# EAGLE schematic base (EAGLE 9.5.1)

## Sheet 1 of 2: ESP32 and peripherals
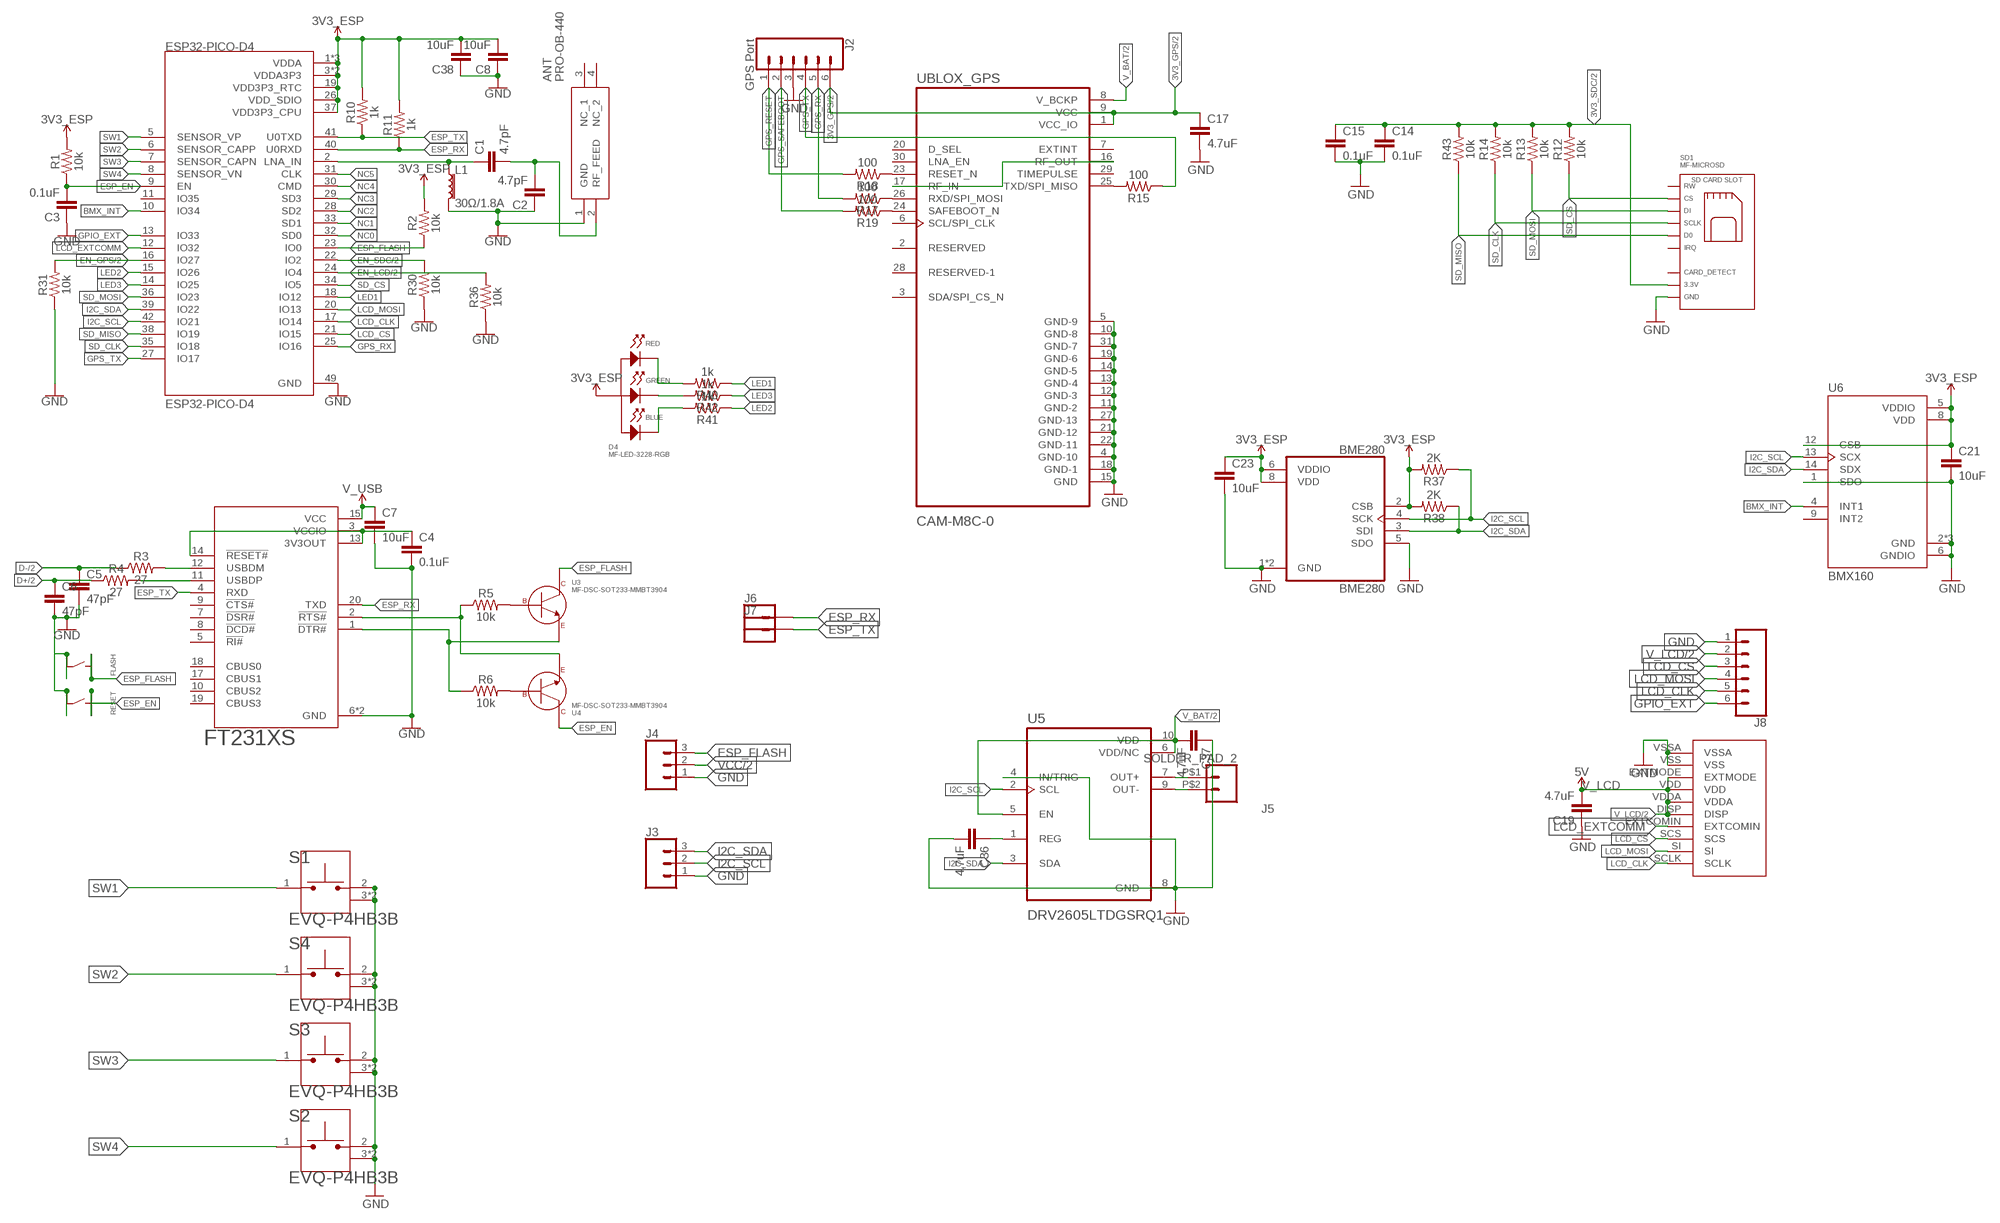
[diagram p0: schematic, sheet 1]

### Parts
ANT  PRO-OB-440  [PRO-OB-440_1]
BME280  BME280  [PSON65P250X250X100-8N]
C1  4.7pF  4.7PF-0603-50V-5%  [C0603]
C2  4.7pF  4.7PF-0603-50V-5%  [C0603]
C3  0.1uF  0.1UF-0603-25V-(+80/-20%)  [C0603]
C4  0.1uF  0.1UF-0603-25V-(+80/-20%)  [C0603]
C5  47pF  47PF-0603-50V-5%  [C0603]
C6  47pF  47PF-0603-50V-5%  [C0603]
C7  10uF  2.2UF-0603-10V-20%  [C0603]
C8  10uF  4.7PF-0603-50V-5%  [C0603]
C14  0.1uF  0.1UF-0603-25V-(+80/-20%)  [C0603]
C15  0.1uF  0.1UF-0603-25V-(+80/-20%)  [C0603]
C17  4.7uF  0.1UF-0603-25V-5%  [C0603]
C19  4.7uF  4.7UF-0603-6.3V-(10%)  [C0603]
C21  10uF  10UF-0603-6.3V-20%  [C0603]
C23  10uF  10UF-0603-6.3V-20%  [C0603]
C36  4.7uF  4.7UF-0603-6.3V-(10%)  [C0603]
C37  4.7uF  4.7UF-0603-6.3V-(10%)  [C0603]
C38  10uF  4.7PF-0603-50V-5%  [C0603]
D4  MF-LED-3228-RGB  LED_RGB_CA_PLCC4  [PLCC4]
ESP32-PICO-D4  ESP32-PICO-D4  [PQFN50P700X700X104-49N]
FLASH  MF-SW-TACT-4.2MM  TACT_4.2MM  [TACT4.2MM]
FT231  FT231XS  FT231XS-UTSSOP20  [TSSOP20]
J2  GPS Port  CONN_06LOCK  [1X06_LOCK]
J3  CONN_03LOCK  [1X03_LOCK]
J4  CONN_03LOCK  [1X03_LOCK]
J5  SOLDER_PAD_2  [SOLDER_PAD_2]
J6  CONN_01  [1X01]
J7  CONN_01  [1X01]
J8  CONN_06LOCK  [1X06_LOCK]
L1  30Ω/1.8A  FERRITE_BEAD-0603  [L0603]
R1  10k  10KOHM-0603-1/10W-1%  [R0603]
R2  10k  10KOHM-0603-1/10W-1%  [R0603]
R3  27  27OHM-0603-1/10W-1%  [R0603]
R4  27  27OHM-0603-1/10W-1%  [R0603]
R5  10k  10KOHM-0603-1/10W-1%  [R0603]
R6  10k  10KOHM-0603-1/10W-1%  [R0603]
R10  1k  1KOHM-0603-1/10W-1%  [R0603]
R11  1k  1KOHM-0603-1/10W-1%  [R0603]
R12  10k  10KOHM-0603-1/10W-1%  [R0603]
R13  10k  10KOHM-0603-1/10W-1%  [R0603]
R14  10k  10KOHM-0603-1/10W-1%  [R0603]
R15  100  1KOHM-0603-1/10W-1%  [R0603]
R17  100  1KOHM-0603-1/10W-1%  [R0603]
R18  100  1KOHM-0603-1/10W-1%  [R0603]
R19  100  1KOHM-0603-1/10W-1%  [R0603]
R30  10k  10KOHM-0603-1/10W-1%  [R0603]
R31  10k  10KOHM-0603-1/10W-1%  [R0603]
R36  10k  10KOHM-0603-1/10W-1%  [R0603]
R37  2K  1KOHM-0603-1/10W-1%  [R0603]
R38  2K  1KOHM-0603-1/10W-1%  [R0603]
R40  1k  1KOHM-0603-1/10W-1%  [R0603]
R41  1k  1KOHM-0603-1/10W-1%  [R0603]
R42  1k  1KOHM-0603-1/10W-1%  [R0603]
R43  10k  10KOHM-0603-1/10W-1%  [R0603]
RESET  MF-SW-TACT-4.2MM  TACT_4.2MM  [TACT4.2MM]
S1  EVQ-P4HB3B  [SW_EVQ-P4HB3B]
S2  EVQ-P4HB3B  [SW_EVQ-P4HB3B]
S3  EVQ-P4HB3B  [SW_EVQ-P4HB3B]
S4  EVQ-P4HB3B  [SW_EVQ-P4HB3B]
SD1  MF-MICROSD  SD_CARD_SLOT_MICRO_RIGHT  [MF-MICROSD]
U3  MF-DSC-SOT233-MMBT3904  NPN_BJTMMBT3904_SOT-23-3  [SOT-23-3]
U4  MF-DSC-SOT233-MMBT3904  NPN_BJTMMBT3904_SOT-23-3  [SOT-23-3]
U5  DRV2605LTDGSRQ1  [SOP50P490X110-10N]
U6  BMX160  [PQFN50P250X300X100-14N]
U$5  51441-1093  LS027B_LCD_SHARPFH12-10S-0.5SH  [FH12-10S-0.5SH]
UBLOX_GPS  CAM-M8C-0  [LCC100P960X1400X210-31N]

### Nets
3V3_GPS: C17.1 J2.6 UBLOX_GPS.1(VCC_IO) UBLOX_GPS.9(VCC) ; also sheet 2
3V3_SDC: C14.1 C15.1 R12.2 R13.2 R14.2 R43.2 SD1.PIN4(3.3V) ; also sheet 2
BMX_INT: ESP32-PICO-D4.10(IO34) U6.4(INT1)
D+: C6.1 R4.1 ; also sheet 2
D-: C5.1 R3.1 ; also sheet 2
EN_GPS: ESP32-PICO-D4.16(IO27) R31.2 ; also sheet 2
EN_LCD: ESP32-PICO-D4.24(IO4) R36.2 ; also sheet 2
EN_SDC: ESP32-PICO-D4.22(IO2) R30.2 ; also sheet 2
ESP_EN: C3.2 ESP32-PICO-D4.9(EN) R1.1 RESET.P$1 RESET.P$2 U4.P$3(COLLECTOR)
ESP_FLASH: ESP32-PICO-D4.23(IO0) FLASH.P$1 FLASH.P$2 J4.3 R2.1 U3.P$3(COLLECTOR)
ESP_RX: ESP32-PICO-D4.40(U0RXD) FT231.20(TXD) J6.1 R11.1
ESP_TX: ESP32-PICO-D4.41(U0TXD) FT231.4(RXD) J7.1 R10.1
GND: ANT.1(GND) BME280.1(GND) BME280.5(SDO) BME280.7(GND) C2.1 C3.1 C4.2 C5.2 C6.2 C7.2 C8.1 C14.2 C15.2 C17.2 C19.1 C21.2 C23.2 C36.2 C37.1 C38.1 ESP32-PICO-D4.49(GND) FLASH.P$3 FLASH.P$4 FT231.6(GND) FT231.16(GND) J2.3 J3.1 J4.1 J8.1 L1.2 R30.1 R31.1 R36.1 RESET.P$3 RESET.P$4 S1.2 S1.3(SHIELD) S1.4(SHIELD) S2.2 S2.3(SHIELD) S2.4(SHIELD) S3.2 S3.3(SHIELD) S3.4(SHIELD) S4.2 S4.3(SHIELD) S4.4(SHIELD) SD1.G0(GND) SD1.G1(GND) SD1.PIN6(GND) U5.4(IN/TRIG) U5.8(GND) U6.1(SDO) U6.2(GND) U6.3(GND) U6.6(GNDIO) U6.7(GND) U$5.VSS U$5.VSSA UBLOX_GPS.4(GND-10) UBLOX_GPS.5(GND-9) UBLOX_GPS.10(GND-8) UBLOX_GPS.11(GND-2) UBLOX_GPS.12(GND-3) UBLOX_GPS.13(GND-4) UBLOX_GPS.14(GND-5) UBLOX_GPS.15(GND) UBLOX_GPS.18(GND-1) UBLOX_GPS.19(GND-6) UBLOX_GPS.21(GND-12) UBLOX_GPS.22(GND-11) UBLOX_GPS.27(GND-13) UBLOX_GPS.31(GND-7) ; also sheet 2
GPIO_EXT: ESP32-PICO-D4.13(IO33) J8.6
GPS_RESET: J2.1 R18.2
GPS_RX: ESP32-PICO-D4.25(IO16) J2.5 R17.2
GPS_SAFEBOOT: J2.2 R19.2
GPS_TX: ESP32-PICO-D4.27(IO17) J2.4 R15.1
I2C_SCL: BME280.4(SCK) ESP32-PICO-D4.42(IO21) J3.2 R37.1 U5.2(SCL) U6.13(SCX) ; also sheet 2
I2C_SDA: BME280.3(SDI) ESP32-PICO-D4.39(IO22) J3.3 R38.1 U5.3(SDA) U6.14(SDX) ; also sheet 2
LCD_CLK: ESP32-PICO-D4.17(IO14) J8.5 U$5.SCLK
LCD_CS: ESP32-PICO-D4.21(IO15) J8.3 U$5.SCS
LCD_EXTCOMM: ESP32-PICO-D4.12(IO32) U$5.EXTCOMIN
LCD_MOSI: ESP32-PICO-D4.20(IO13) J8.4 U$5.SI
LED1: ESP32-PICO-D4.18(IO12) R40.1
LED2: ESP32-PICO-D4.15(IO26) R41.1
LED3: ESP32-PICO-D4.14(IO25) R42.1
N$1: C1.1 ESP32-PICO-D4.2(LNA_IN) L1.1
N$2: ANT.2(RF_FEED) C1.2 C2.2
N$3: R5.2 U3.P$1(BASE)
N$4: R6.2 U4.P$1(BASE)
N$5: C4.1 FT231.3(VCCIO) FT231.13(3V3OUT) FT231.14(!RESET#)
N$6: FT231.12(USBDM) R3.2
N$7: FT231.11(USBDP) R4.2
N$8: FT231.2(!RTS#) R5.1 U4.P$2(EMITTER)
N$9: FT231.1(!DTR#) R6.1 U3.P$2(EMITTER)
N$28: D4.P$2(CATHODE_RED) R40.2
N$29: R15.2 UBLOX_GPS.25(TXD/SPI_MISO)
N$30: R17.1 UBLOX_GPS.26(RXD/SPI_MOSI)
N$32: D4.P$3(CATHODE_GREEN) R42.2
N$33: D4.P$4(CATHODE_BLUE) R41.2
N$34: UBLOX_GPS.16(RF_OUT) UBLOX_GPS.17(RF_IN)
N$37: R18.1 UBLOX_GPS.23(RESET_N)
N$38: R19.1 UBLOX_GPS.24(SAFEBOOT_N)
N$41: C36.1 U5.1(REG)
N$50: J5.P$2 U5.9(OUT-)
N$51: J5.P$1 U5.7(OUT+)
NC0: ESP32-PICO-D4.32(SD0)
NC1: ESP32-PICO-D4.33(SD1)
NC2: ESP32-PICO-D4.28(SD2)
NC3: ESP32-PICO-D4.29(SD3)
NC4: ESP32-PICO-D4.30(CMD)
NC5: ESP32-PICO-D4.31(CLK)
SD_CLK: ESP32-PICO-D4.35(IO18) R14.1 SD1.PIN5(SCLK)
SD_CS: ESP32-PICO-D4.34(IO5) R12.1 SD1.PIN2(CS)
SD_MISO: ESP32-PICO-D4.38(IO19) R43.1 SD1.PIN7(D0)
SD_MOSI: ESP32-PICO-D4.36(IO23) R13.1 SD1.PIN3(DI)
SW1: ESP32-PICO-D4.5(SENSOR_VP) S1.1
SW2: ESP32-PICO-D4.6(SENSOR_CAPP) S4.1
SW3: ESP32-PICO-D4.7(SENSOR_CAPN) S3.1
SW4: ESP32-PICO-D4.8(SENSOR_VN) S2.1
V_BAT: C37.2 U5.5(EN) U5.6(VDD/NC) U5.10(VDD) UBLOX_GPS.8(V_BCKP) ; also sheet 2
V_LCD: C19.2 J8.2 U$5.DISP U$5.EXTMODE U$5.VDD U$5.VDDA ; supply symbol labelled 5V ; also sheet 2
V_USB: C7.1 FT231.15(VCC) ; also sheet 2
VCC: BME280.2(CSB) BME280.6(VDDIO) BME280.8(VDD) C8.2 C21.1 C23.1 C38.2 D4.P$1(ANODE) ESP32-PICO-D4.1(VDDA) ESP32-PICO-D4.3(VDDA3P3) ESP32-PICO-D4.4(VDDA3P3) ESP32-PICO-D4.19(VDD3P3_RTC) ESP32-PICO-D4.26(VDD_SDIO) ESP32-PICO-D4.37(VDD3P3_CPU) ESP32-PICO-D4.43(VDDA) ESP32-PICO-D4.46(VDDA) J4.2 R1.2 R2.2 R10.2 R11.2 R37.2 R38.2 U6.5(VDDIO) U6.8(VDD) U6.12(CSB) ; supply symbol labelled 3V3_ESP ; also sheet 2
Unconnected: ANT.3(NC_1) ANT.4(NC_2) ESP32-PICO-D4.11(IO35) FT231.5(!RI#) FT231.7(!DSR#) FT231.8(!DCD#) FT231.9(!CTS#) FT231.10(CBUS2) FT231.17(CBUS1) FT231.18(CBUS0) FT231.19(CBUS3) SD1.PIN1(RW) SD1.PIN8(IRQ) SD1.PIN9(CRD_DTCT) SD1.PIN10(CRD_DTCT) U6.9(INT2) UBLOX_GPS.2(RESERVED) UBLOX_GPS.3(SDA/SPI_CS_N) UBLOX_GPS.6(SCL/SPI_CLK) UBLOX_GPS.7(EXTINT) UBLOX_GPS.20(D_SEL) UBLOX_GPS.28(RESERVED-1) UBLOX_GPS.29(TIMEPULSE) UBLOX_GPS.30(LNA_EN)

## Sheet 2 of 2: Power
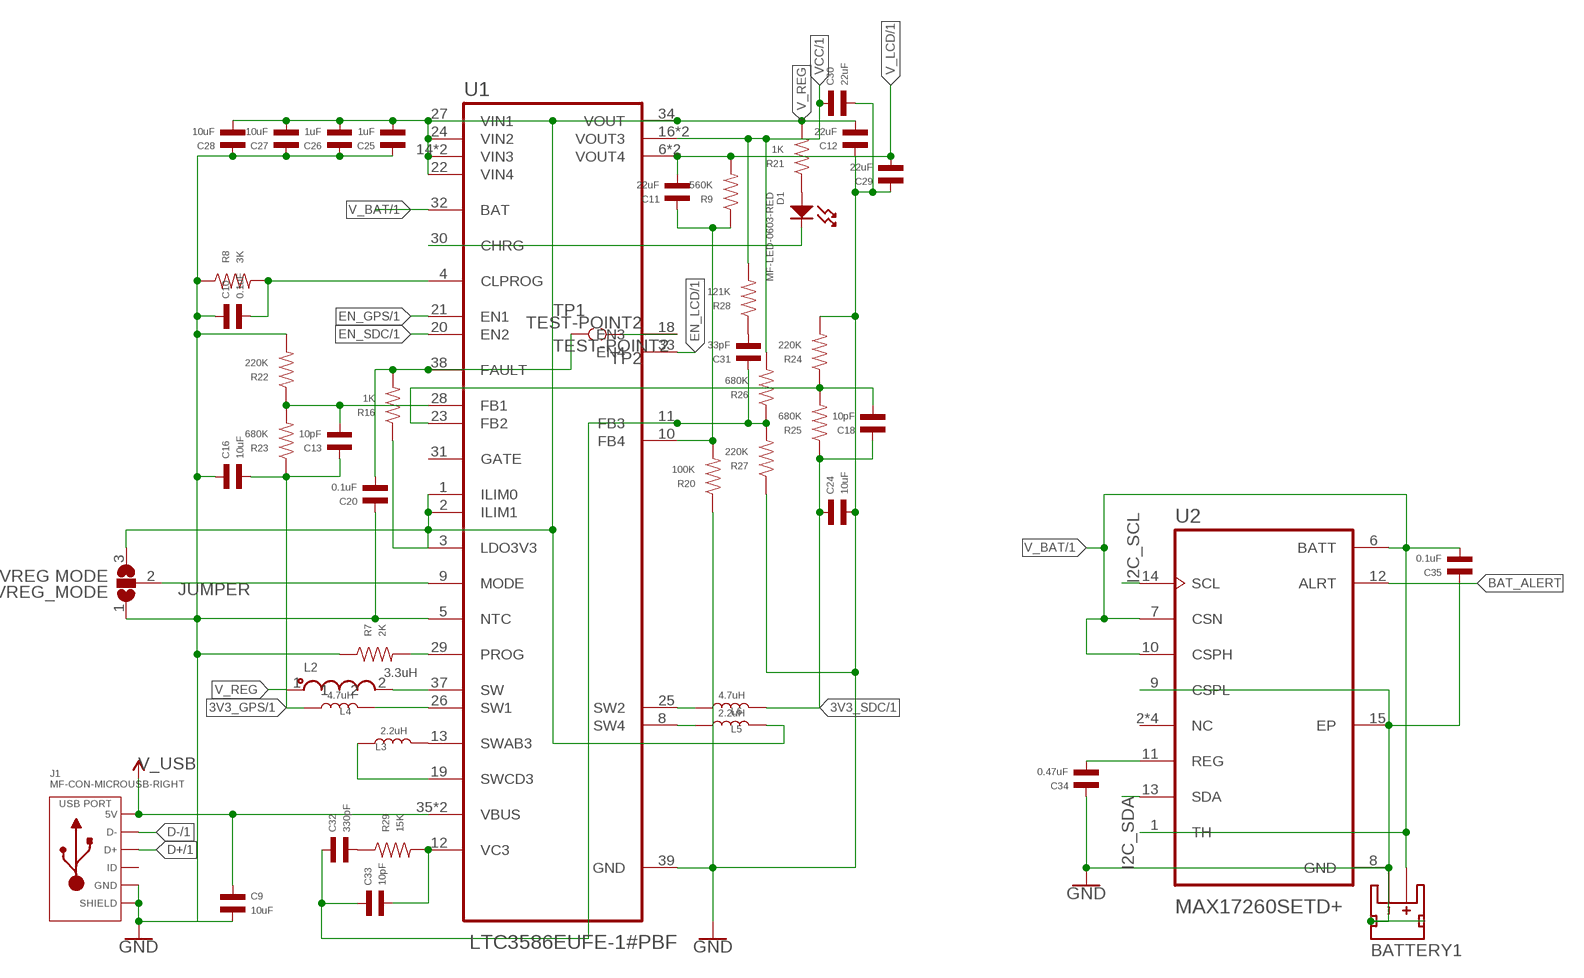
[diagram p1: schematic, sheet 2]

### Parts
BATTERY1  S2B-PH-SM4-TB(LF)(SN)  JST_2MM_MALE  [JST-2-SMD]
C9  10uF  CAPACITOR_NP_0603  [C0603]
C10  0.1uF  CAPACITOR_NP_0603  [C0603]
C11  22uF  CAPACITOR_NP_0603  [C0603]
C12  22uF  CAPACITOR_NP_0603  [C0603]
C13  10pF  CAPACITOR_NP_0603  [C0603]
C16  10uF  CAPACITOR_NP_0603  [C0603]
C18  10pF  CAPACITOR_NP_0603  [C0603]
C20  0.1uF  CAPACITOR_NP_0603  [C0603]
C24  10uF  CAPACITOR_NP_0603  [C0603]
C25  1uF  CAPACITOR_NP_0603  [C0603]
C26  1uF  CAPACITOR_NP_0603  [C0603]
C27  10uF  CAPACITOR_NP_0603  [C0603]
C28  10uF  CAPACITOR_NP_0603  [C0603]
C29  22uF  CAPACITOR_NP_0603  [C0603]
C30  22uF  CAPACITOR_NP_0603  [C0603]
C31  33pF  CAPACITOR_NP_0603  [C0603]
C32  330pF  CAPACITOR_NP_0603  [C0603]
C33  10pF  CAPACITOR_NP_0603  [C0603]
C34  0.47uF  CAPACITOR_NP_0603  [C0603]
C35  0.1uF  CAPACITOR_NP_0603  [C0603]
D1  MF-LED-0603-RED  LED_SINGLE-0603-RED  [LED0603]
J1  MF-CON-MICROUSB-RIGHT  USB_MICRO_RIGHT  [MICROUSB-RIGHT]
L2  3.3uH  LPS4018-472MRB  [INDP_LPS4018-472MRB]
L3  2.2uH  INDUCTOR_1210  [L1210]
L4  4.7uH  INDUCTOR_1210  [L1210]
L5  2.2uH  INDUCTOR_1210  [L1210]
L6  4.7uH  INDUCTOR_1210  [L1210]
R7  2K  RESISTOR_0603  [R0603]
R8  3K  RESISTOR_0603  [R0603]
R9  560K  RESISTOR_0603  [R0603]
R16  1K  RESISTOR_0603  [R0603]
R20  100K  RESISTOR_0603  [R0603]
R21  1K  RESISTOR_0603  [R0603]
R22  220K  RESISTOR_0603  [R0603]
R23  680K  RESISTOR_0603  [R0603]
R24  220K  RESISTOR_0603  [R0603]
R25  680K  RESISTOR_0603  [R0603]
R26  680K  RESISTOR_0603  [R0603]
R27  220K  RESISTOR_0603  [R0603]
R28  121K  RESISTOR_0603  [R0603]
R29  15K  RESISTOR_0603  [R0603]
TP1  TEST-POINT2  [PAD.02X.02]
TP2  TEST-POINT2  [PAD.02X.02]
U1  LTC3586EUFE-1#PBF  LTC3586EUFE-3#TRPBF  [QFN40P600X400X80-39N]
U2  MAX17260SETD+  [SON40P300X300X80-15N]
VREG_MODE  VREG MODE  SJ2W  [SJ_2]

### Nets
3V3_GPS: C13.P$1 C16.P$2 L4.P$1 R23.P$1 ; also sheet 1
3V3_SDC: C18.P$1 C24.P$1 L6.P$2 R25.P$1 ; also sheet 1
BAT_ALERT: U2.12(ALRT)
D+: J1.3(D+) ; also sheet 1
D-: J1.2(D-) ; also sheet 1
EN_GPS: U1.21(EN1) ; also sheet 1
EN_LCD: U1.33(EN4) ; also sheet 1
EN_SDC: U1.20(EN2) ; also sheet 1
GND: BATTERY1.1(-) BATTERY1.NC1(PAD1) BATTERY1.NC2(PAD2) C9.P$2 C10.P$1 C12.P$1 C16.P$1 C20.P$1 C24.P$2 C25.P$1 C26.P$1 C27.P$1 C28.P$1 C29.P$1 C30.P$2 C34.P$1 C35.P$1 J1.5(GND) J1.S1(SLD) J1.S2(SLD) J1.S3(SLD) J1.S4(SLD) J1.S5(SLD) J1.S6(SLD) R7.P$1 R8.P$1 R20.P$1 R22.P$2 R24.P$2 R27.P$1 U1.5(NTC) U1.39(GND) U2.8(GND) U2.9(CSPL) U2.15(EP) VREG_MODE.1 ; also sheet 1
I2C_SCL: U2.14(SCL) ; also sheet 1
I2C_SDA: U2.13(SDA) ; also sheet 1
JUMPER: U1.9(MODE) VREG_MODE.2
N$10: R7.P$2 U1.29(PROG)
N$11: C10.P$2 R8.P$2 U1.4(CLPROG)
N$12: C11.P$1 R9.P$1 R20.P$2 U1.10(FB4)
N$13: L3.P$2 U1.13(SWAB3)
N$14: C31.P$1 C32.P$1 C33.P$1 R26.P$1 R27.P$2 U1.11(FB3)
N$15: L2.2 U1.37(SW)
N$16: D1.CATHODE U1.30(CHRG)
N$17: D1.ANODE R21.P$1
N$18: L3.P$1 U1.19(SWCD3)
N$19: TP2.P$1 U1.18(EN3)
N$20: L4.P$2 U1.26(SW1)
N$21: C13.P$2 R22.P$1 R23.P$2 U1.28(FB1)
N$22: L5.P$1 U1.8(SW4)
N$24: C20.P$2 R16.P$2 TP1.P$1 U1.38(FAULT)
N$26: C18.P$2 R24.P$1 R25.P$2 U1.23(FB2)
N$27: L6.P$1 U1.25(SW2)
N$31: C31.P$2 R28.P$1
N$43: C33.P$2 R29.P$2 U1.12(VC3)
N$44: C32.P$2 R29.P$1
N$47: C34.P$2 U2.11(REG)
V_BAT: BATTERY1.2(+) C35.P$2 U1.32(BAT) U2.1(TH) U2.6(BATT) U2.7(CSN) U2.10(CSPH) ; also sheet 1
V_LCD: C11.P$2 C29.P$2 R9.P$2 U1.6(VOUT4) U1.7(VOUT4) ; also sheet 1
V_REG: C12.P$2 C25.P$2 C26.P$2 C27.P$2 C28.P$2 L2.1 L5.P$2 R16.P$1 R21.P$2 U1.1(ILIM0) U1.2(ILIM1) U1.3(LDO3V3) U1.14(VIN3) U1.15(VIN3) U1.22(VIN4) U1.24(VIN2) U1.27(VIN1) U1.34(VOUT) VREG_MODE.3
V_USB: C9.P$1 J1.1(5V) U1.35(VBUS) U1.36(VBUS) ; also sheet 1
VCC: C30.P$1 R26.P$2 R28.P$2 U1.16(VOUT3) U1.17(VOUT3) ; also sheet 1
Unconnected: J1.4(ID) U1.31(GATE) U2.2(NC) U2.3(NC) U2.4(NC) U2.5(NC)

## Library data of the parts
ANT = PRO-OB-440:PRO-OB-440: OnBoard SMD 2400 antenna Source: Datasheet <http://www.proant.se/files/user/Datasheet - OnBoard SMD 2400 MHz rev 2.0.pdf>; DESCRIPTION: OnBoard SMD 2400 antenna; HEIGHT: mm; MANUFACTURER_NAME: Proant AB; MANUFACTURER_PART_NUMBER: PRO-OB-440
BATTERY1 = SparkFun-Connectors:JST_2MM_MALE: JST 2MM MALE RA CONNECTOR Two pin, compact surface mount connector. Commonly used as a battery input connection point. We really like the solid locking feeling and high current rating on these small connectors. We use these all the time as battery connectors. Mates to single-cell LiPo batteries. Here is the connector we sell at SparkFun: JST Right Angle Connector - White <https://www.sparkfun.com/products/8612> (PRT-08612) Datasheet <http://www.sparkfun.com/datasheets/Prototyping/Connectors/JST-Horizontal.pdf> It was used on these SparkFun products: SparkFun MOSFET Power Controller <https://www.sparkfun.com/products/11214> (PRT-11214) SparkFun Battery Babysitter - LiPo Battery Manager <https://www.sparkfun.com/products/13777> (PRT-13777) And many, many others that required a lipo battery connection.; PROD_ID: CONN-11443; SF_ID: PRT-08612; SPICEPREFIX: E
BME280 = BME280:BME280: DIGITAL HUMIDITY, PRESSURE AND TEMPERATURE SENSOR * Digital interface I²C (up to 3.4 MHz) and SPI (3 and 4 wire, up to 10 MHz)* Supply voltage VDD main supply voltage range: 1.71 V to 3.6 V*VDDIO interface voltage range: 1.2 V to 3.6 V Operating range -40…+85 °C, 0…100 % rel. humidity, 300…1100 hPa The library has been designed by Richard Magdycz <https://www.facebook.com/groups/eaglecadsoftUK>; AVAILABILITY: Unavailable; DESCRIPTION: Integrated pressure, humidity and temperature sensor; 8-pin 2.5x2.5x0.93mm LGA; MF: Bosch; MP: BME280; PACKAGE: LGA-8 Bosch; PRICE: None
C1 C2 = SparkFun-Capacitors:4.7PF: 4.7pF ceramic capacitors A capacitor is a passive two-terminal electrical component used to store electrical energy temporarily in an electric field.; PROD_ID: CAP-07880
C3 C4 C14 C15 = SparkFun-Capacitors:0.1UF: 0.1µF ceramic capacitors A capacitor is a passive two-terminal electrical component used to store electrical energy temporarily in an electric field.; PROD_ID: CAP-00810
C5 C6 = SparkFun-Capacitors:47PF: 47pF ceramic capacitors A capacitor is a passive two-terminal electrical component used to store electrical energy temporarily in an electric field.; PROD_ID: CAP-08913
C7 = SparkFun-Capacitors:2.2UF: 2.2µF ceramic capacitors A capacitor is a passive two-terminal electrical component used to store electrical energy temporarily in an electric field.; PROD_ID: CAP-07888; VALUE: 2.2uF
C8 C38 = SparkFun-Capacitors:4.7PF: 4.7pF ceramic capacitors A capacitor is a passive two-terminal electrical component used to store electrical energy temporarily in an electric field.; PROD_ID: CAP-07880; VALUE: 4.7pF
C9-C13 C16 C18 C20 C24-C35 = MF_Passives:CAPACITOR_NP: Library: MF_Passives Description: Device for Non-Polarized Capacitors. Manufacture part number (MPN) can be added via Attributes. Check https://factory.macrofab.com/parts for the house parts list.; POPULATE: 1
C17 = SparkFun-Capacitors:0.1UF: 0.1µF ceramic capacitors A capacitor is a passive two-terminal electrical component used to store electrical energy temporarily in an electric field.; PROD_ID: CAP-08604; VALUE: 0.1uF
C19 C36 C37 = SparkFun-Capacitors:4.7UF: 4.7µF ceramic capacitors A capacitor is a passive two-terminal electrical component used to store electrical energy temporarily in an electric field.; PROD_ID: CAP-08280
C21 C23 = SparkFun-Capacitors:10UF: 10.0µF ceramic capacitors A capacitor is a passive two-terminal electrical component used to store electrical energy temporarily in an electric field.; PROD_ID: CAP-11015
D1 = MF_LEDs:LED_SINGLE: Library: MF_LEDs Description: Device for Single LED Packages. Manufacture part number (MFG#) can be added via Attributes.; HOUSEPART: YES; MPN: MF-LED-0603-RED; POPULATE: 1; URL: https://factory.macrofab.com/part/MF-LED-0603-RED
D4 = MF_LEDs:LED_RGB_CA: Library: MF_LEDs Description: Device for RGB LED Packages with Common Anodes. Manufacture part number (MFG#) can be added via Attributes.; HOUSEPART: YES; MPN: MF-LED-3228-RGB; POPULATE: 1; URL: https://factory.macrofab.com/part/MF-LED-3228-RGB
ESP32-PICO-D4 = ESP32-PICO-D4:ESP32-PICO-D4: The ESP32-PICO-D4 is a System-in-Package (SIP) module that is based on ESP32, providing complete Wi-Fi and Bluetooth functionalities. The module has a size as small as 7.0±0.1 mm×7.0±0.1 mm×0.94±0.1 mm, thus requiring minimal PCB area. The module integrates a 4-MB SPI flash; AVAILABILITY: Unavailable; DESCRIPTION: WIFi/Bluetooth SIP; MF: Espressif Systems; MP: ESP32-PICO-D4; PACKAGE: SMD-48 Espressif Systems; PRICE: None
FLASH RESET = MF_Switches:TACT: Library: MF_Switches Description: Device for Tact Switches. Manufacture part number (MFG#) can be added via Attributes.; HOUSEPART: YES; MPN: MF-SW-TACT-4.2MM; POPULATE: 1; URL: https://factory.macrofab.com/part/MF-SW-TACT-4.2MM
FT231 = FT231XS-U:FT231XS-U: USB Full Speed to Full Handshake UART with USB Charger Detection, SSOP-20; SPICEPREFIX: F
J1 = MF_Connectors:USB: Library: MF_Connectors Description: 5 Pin USB Connectors. SLD is the shield connection. Usually tied to ground through a small ferrite bead.; HOUSEPART: YES; MPN: MF-CON-MICROUSB-RIGHT; POPULATE: 1; URL: https://factory.macrofab.com/part/MF-CON-MICROUSB-RIGHT
J2 J8 = SparkFun-Connectors:CONN_06: Multi connection point. Often used as Generic Header-pin footprint for 0.1 inch spaced/style header connections On any of the 0.1 inch spaced packages, you can populate with these: Break Away Headers - Straight <https://www.sparkfun.com/products/116> (PRT-00116) Break Away Male Headers - Right Angle <https://www.sparkfun.com/products/553> (PRT-00553) Female Headers <https://www.sparkfun.com/products/115> (PRT-00115) Break Away Headers - Machine Pin <https://www.sparkfun.com/products/117> (PRT-00117) Break Away Female Headers - Swiss Machine Pin <https://www.sparkfun.com/products/743> (PRT-00743) Arduino Stackable Header - 6 Pin <https://www.sparkfun.com/products/9280> (PRT-09280) For SCREWTERMINALS and SPRING TERMINALS visit here: Screw Terimnals on SparkFun.com <https://www.sparkfun.com/search/results?term=Screw+Terminals> (5mm/3.5mm/2.54mm spacing) This device is also useful as a general connection point to wire up your design to another part of your project. Our various solder wires solder well into these plated through hole pads. Hook-Up Wire - Assortment (Stranded, 22 AWG) <https://www.sparkfun.com/products/11375> (PRT-11375) Hook-Up Wire - Assortment (Solid Core, 22 AWG) <https://www.sparkfun.com/products/11367> (PRT-11367) View the entire wire category on our website here <https://www.sparkfun.com/categories/141>; DNP: 1
J3 J4 = SparkFun-Connectors:CONN_03: Multi connection point. Often used as Generic Header-pin footprint for 0.1 inch spaced/style header connections On any of the 0.1 inch spaced packages, you can populate with these: Break Away Headers - Straight <https://www.sparkfun.com/products/116> (PRT-00116) Break Away Male Headers - Right Angle <https://www.sparkfun.com/products/553> (PRT-00553) Female Headers <https://www.sparkfun.com/products/115> (PRT-00115) Break Away Headers - Machine Pin <https://www.sparkfun.com/products/117> (PRT-00117) Break Away Female Headers - Swiss Machine Pin <https://www.sparkfun.com/products/743> (PRT-00743) Stackable Header - 3 Pin (Female, 0.1") <https://www.sparkfun.com/products/13875> (PRT-13875) For SCREWTERMINALS and SPRING TERMINALS visit here: Screw Terimnals on SparkFun.com <https://www.sparkfun.com/search/results?term=Screw+Terminals> (5mm/3.5mm/2.54mm spacing) This device is also useful as a general connection point to wire up your design to another part of your project. Our various solder wires solder well into these plated through hole pads. Hook-Up Wire - Assortment (Stranded, 22 AWG) <https://www.sparkfun.com/products/11375> (PRT-11375) Hook-Up Wire - Assortment (Solid Core, 22 AWG) <https://www.sparkfun.com/products/11367> (PRT-11367) View the entire wire category on our website here <https://www.sparkfun.com/categories/141> Special notes: Molex polarized connector foot print use with SKU : PRT-08232 with associated crimp pins and housings.; DNP: 1
J5 = SparkFun-Connectors:SOLDER_PAD_2: Solder Pad for LuMini Rings
J6 J7 = SparkFun-Connectors:CONN_01: Single connection point. Often used as Generic Header-pin footprint for 0.1 inch spaced/style header connections On any of the 0.1 inch spaced packages, you can populate with these: Break Away Headers - Straight <https://www.sparkfun.com/products/116> (PRT-00116) Break Away Male Headers - Right Angle <https://www.sparkfun.com/products/553> (PRT-00553) Female Headers <https://www.sparkfun.com/products/115> (PRT-00115) Break Away Headers - Machine Pin <https://www.sparkfun.com/products/117> (PRT-00117) Break Away Female Headers - Swiss Machine Pin <https://www.sparkfun.com/products/743> (PRT-00743) This device is also useful as a general connection point to wire up your design to another part of your project. Our various solder wires solder well into these plated through hole pads. Hook-Up Wire - Assortment (Stranded, 22 AWG) <https://www.sparkfun.com/products/11375> (PRT-11375) Hook-Up Wire - Assortment (Solid Core, 22 AWG) <https://www.sparkfun.com/products/11367> (PRT-11367) View the entire wire category on our website here <https://www.sparkfun.com/categories/141> Special notes: SMTSO-256-ET is a "flush mount" nut for a 4-40 screw. We mostly use this on specialty testbeds; it is a nice way to connect hardware to your PCB at an adjustable hieght. Also note, the SNAP packages are for using a snappable style connector. We sell a baggie of snaps and they are also used on two LilyPad designs: Snap Assortment - 30 pack (male and female) <https://www.sparkfun.com/products/11347> (DEV-11347) LilyPad Arduino SimpleSnap <https://www.sparkfun.com/products/10941> (DEV-10941) LilyPad SimpleSnap Protoboard <https://www.sparkfun.com/products/10940> (DEV-10940); DNP: 1
L1 = SparkFun-Coils:FERRITE_BEAD: Ferrite Bead (blocks, cores, rings, chokes, etc.) Inductor with layers of ferrite used to suppress high frequencies. Often used to isolate high frequency noise. SparkFun Products: IOIO-OTG - V2.2 <https://www.sparkfun.com/products/13613> SparkFun SAMD21 Mini Breakout <https://www.sparkfun.com/products/13664> SparkFun 6 Degrees of Freedom Breakout - LSM6DS3 <https://www.sparkfun.com/products/13339> SparkFun SAMD21 Dev Breakout <https://www.sparkfun.com/products/13672>; MPN: 744761016C; PROD_ID: NDUC-13805
L2 = LPS4018-472MRB:LPS4018-472MRB: Power inductor, shielded, 20/30% tol, SMT, RoHS, lead-free, halogen-free; AVAILABILITY: Unavailable; DESCRIPTION: Power inductor, shielded, 20/30% tol, SMT, RoHS, lead-free, halogen-free; MF: Coilcraft; MP: LPS4018-472MRB; MPN: LPS4018-472MRB; PACKAGE: None; PRICE: None
L3 L5 = MF_Passives:INDUCTOR: Library: MF_Passives Description: Device for Inductors. Manufacture part number (MPN) can be added via Attributes. Check https://factory.macrofab.com/parts for the house parts list.; MPN: L1210R2R2MDWIT
L4 L6 = MF_Passives:INDUCTOR: Library: MF_Passives Description: Device for Inductors. Manufacture part number (MPN) can be added via Attributes. Check https://factory.macrofab.com/parts for the house parts list.; MPN: L1210R4R7MDWIT
R1 R2 R5 R6 R12-R14 R30 R31 R36 R43 = SparkFun-Resistors:10KOHM: 10kΩ resistor A resistor is a passive two-terminal electrical component that implements electrical resistance as a circuit element. Resistors act to reduce current flow, and, at the same time, act to lower voltage levels within circuits. - Wikipedia; PROD_ID: RES-00824
R3 R4 = SparkFun-Resistors:27OHM: 27Ω resistor A resistor is a passive two-terminal electrical component that implements electrical resistance as a circuit element. Resistors act to reduce current flow, and, at the same time, act to lower voltage levels within circuits. - Wikipedia; PROD_ID: RES-09334
R7-R9 R16 R20-R29 = MF_Passives:RESISTOR: Library: MF_Passives Description: Device for Resistors. Manufacture part number (MPN), Voltage, Tolerance, and Wattage Rating can be added via Attributes. Check https://factory.macrofab.com/parts for the house parts list.; POPULATE: 1
R10 R11 R40-R42 = SparkFun-Resistors:1KOHM: 1kΩ resistor A resistor is a passive two-terminal electrical component that implements electrical resistance as a circuit element. Resistors act to reduce current flow, and, at the same time, act to lower voltage levels within circuits. - Wikipedia; PROD_ID: RES-07856
R15 R17 R37 R38 = SparkFun-Resistors:1KOHM: 1kΩ resistor A resistor is a passive two-terminal electrical component that implements electrical resistance as a circuit element. Resistors act to reduce current flow, and, at the same time, act to lower voltage levels within circuits. - Wikipedia; PROD_ID: RES-07856; VALUE: 1k
R18 R19 = SparkFun-Resistors:1KOHM: 1kΩ resistor A resistor is a passive two-terminal electrical component that implements electrical resistance as a circuit element. Resistors act to reduce current flow, and, at the same time, act to lower voltage levels within circuits. - Wikipedia; DNP: 1; PROD_ID: RES-07856; VALUE: 1k
S1-S4 = EVQ-P4HB3B:EVQ-P4HB3B: Light Touch Switch, 3.5x2.9mm Right Angl Side-operational L-Shape, Force=2.2N, H=1.35mm,; AVAILABILITY: Unavailable; DESCRIPTION: Tactile Switch SPST-NO Side Actuated Edge Mount, Right Angle; MF: Panasonic Electronic; MP: EVQ-P4HB3B; PACKAGE: None; PRICE: None
SD1 = MF_Connectors:SD_CARD_SLOT: Library: MF_Connectors Description: SD Card Connector; HOUSEPART: YES; MPN: MF-MICROSD; POPULATE: 1; URL: https://factory.macrofab.com/part/MF-MICROSD
TP1 TP2 = SparkFun-Connectors:TEST-POINT: SparkFun Test Points Bare copper test points for troubleshooting or In-Circuit-Testing. These are used by our Production team for verifying production board runs using pogo-pins on test beds. SparkFun Products: SparkFun LSM9DS1 Breakout <https://www.sparkfun.com/products/13284> SparkFun PSOC <https://www.sparkfun.com/products/13714> SparkFun Load Cell Amplifier <https://www.sparkfun.com/products/13879>
U1 = LTC3586EUFE-3_TRPBF:LTC3586EUFE-3#TRPBF: None; AVAILABILITY: Unavailable; DESCRIPTION: USB Power Manager 4.35V to 5.5V 38-Pin QFN EP T/R; MF: Analog Devices; MP: LTC3586EUFE; PACKAGE: QFN -38 Analog Devices; PRICE: None
U2 = MAX17260SETD_coulomb:MAX17260SETD+: None; AVAILABILITY: Unavailable; DESCRIPTION: Fuel Gauge Li+/LiFePO4 1-Cell 2-Wire Interface 5.1uA 0.4V 14-Pin TDFN-EP Tube; MF: Maxim Integrated; MP: MAX17260SETD+; PACKAGE: TDFN-14 Maxim; PRICE: None
U3 U4 = MF_Discrete_Semiconductor:NPN_BJT: Library: MF_Discrete_Semiconductor Description: Device for Single NPN BJT Transistors. Manufacture part number (MFG#) can be added via Attributes.; HOUSEPART: YES; MPN: MF-DSC-SOT233-MMBT3904; POPULATE: 1; URL: https://factory.macrofab.com/part/MF-DSC-SOT233-MMBT3904
U5 = DRV2605LTDGSRQ1:DRV2605LTDGSRQ1: None; AVAILABILITY: Unavailable; DESCRIPTION: Haptic Driver for ERM and LRA With Built-In Library and Smart Loop A 10-VSSOP -40 to 105; MF: Texas Instruments; MP: DRV2605LTDGSRQ1; PACKAGE: TFSOP-10 Texas Instruments; PRICE: None
U6 = BMX160:BMX160: IMU ACCEL/GYRO/MAG; AVAILABILITY: Unavailable; DESCRIPTION: Accelerometer, Gyroscope, Magnetometer, 9 Axis Sensor I²C, SPI Output; MF: Bosch Sensortec; MP: BMX160; PACKAGE: VFLGA-14 Bosch Sensortec; PRICE: None
U$5 = myLib:LS027B_LCD_SHARP; MPN: 51441-1093
UBLOX_GPS = CAM-M8C-0:CAM-M8C-0: None; AVAILABILITY: Unavailable; DESCRIPTION: Ic Receiver Gps Chip Ant 31lcc; MF: U-Blox America; MP: CAM-M8C-0; PACKAGE: SMD-31 u-blox; PRICE: None
VREG_MODE = jumper:SJ2W: SMD solder JUMPER